# Altium project 1090-MHz-ADS-B-Receiver.PrjPcb
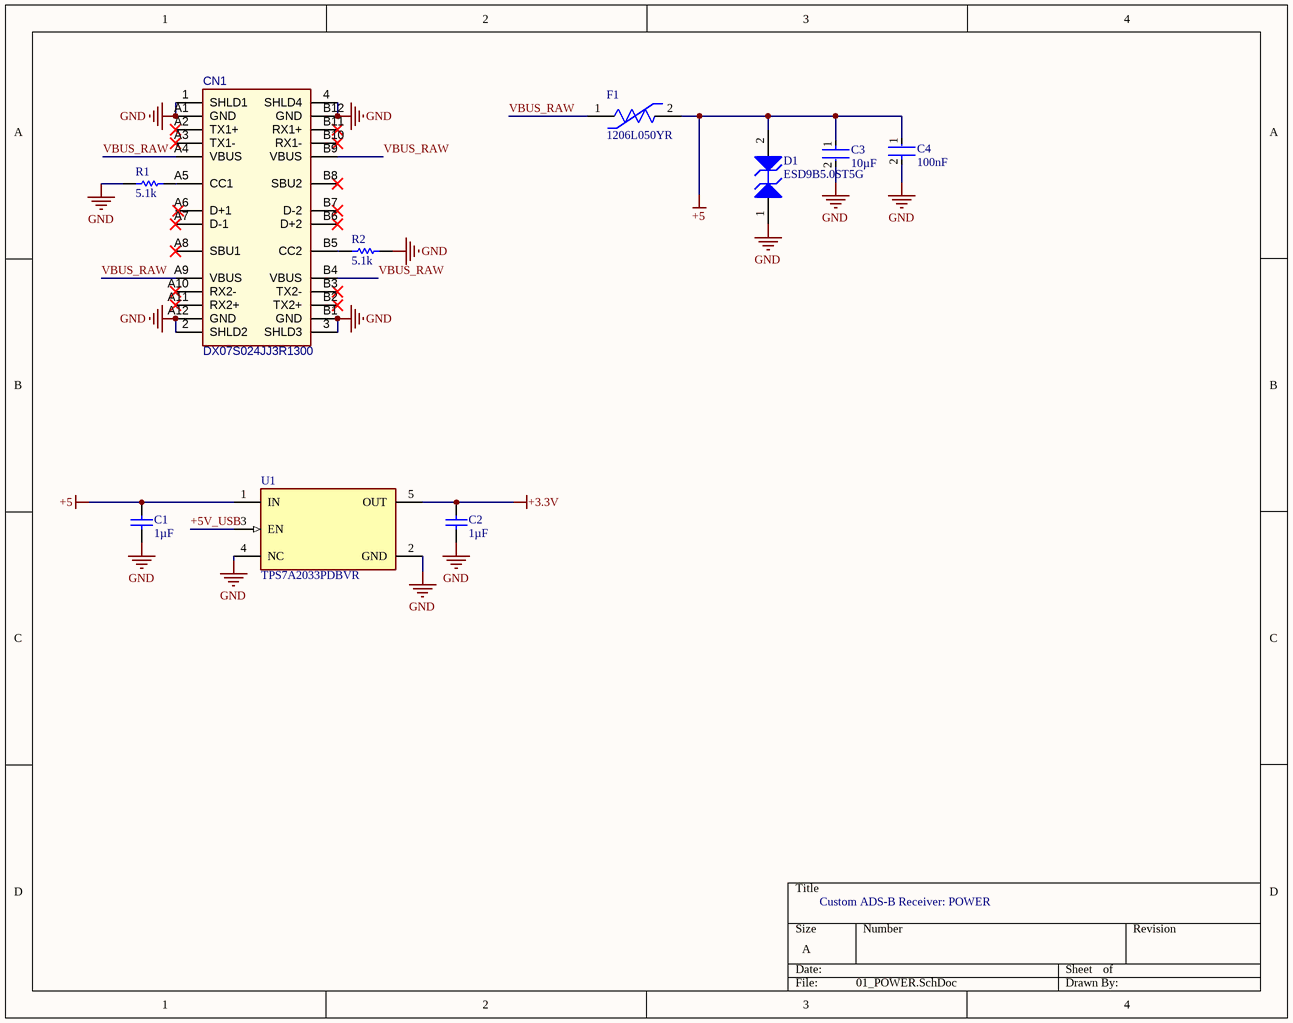
[diagram p0: 01_POWER.SchDoc]
3 sheets, 30 parts. Net scope: global (net labels, ports and power ports of the same name join across sheets).
Board file: PCB1.PcbDoc
Sheets:
  01_POWER.SchDoc
  02_RF_FRONT_END.SchDoc
  03_DETECTOR_COMPARATOR.SchDoc

## Sheet 01_POWER.SchDoc
size A; SheetNumber: 1; SheetTotal: 3

### Parts
C1  value 1µF  [RESC1608X100N]  (hidden comment: GRM188R61A105KA61D)
C2  value 1µF  [RESC1608X100N]  (hidden comment: GRM188R61A105KA61D)
C3  value 10µF  [FP-GRM18-0_15-MFG]  (hidden comment: GRM188R61A106KE69D)
C4  value 100nF  [FP-GRM15-MFG]  (hidden comment: GRM155R71C104KA88D)
CN1  DX07S024JJ3R1300  [JAE-DX07S024JJ3_V]
D1  ESD9B5.0ST5G  [ONSC-SOD-923-2-514AB-01_V]
F1  1206L050YR  [FP-1206L050YR-MFG]
R1  value 5.1k  [RESC1005X40X25NL05T10]  (hidden comment: RC0402FR-075K1L)
R2  value 5.1k  [RESC1005X40X25NL05T10]  (hidden comment: RC0402FR-075K1L)
U1  TPS7A2033PDBVR  [FP-DBV0005A-MFG]

### Nets
+3.3V: C2.2 U1.5(OUT)
+5: C1.2 C3.1 C4.1 D1.2(A2) F1.2 U1.1(IN)
GND: C1.1 C2.1 C3.2 C4.2 CN1.1(SHLD1) CN1.2(SHLD2) CN1.3(SHLD3) CN1.4(SHLD4) CN1.A1(GND) CN1.A12(GND) CN1.B1(GND) CN1.B12(GND) D1.1(A1) R1.1 R2.2 U1.2(GND) U1.4(NC)
+5V_USB: U1.3(EN)
VBUS_RAW: CN1.A4(VBUS) CN1.A9(VBUS) CN1.B4(VBUS) CN1.B9(VBUS) F1.1
NetCN1_A5: CN1.A5(CC1) R1.2
NetCN1_B5: CN1.B5(CC2) R2.1

Not connected (* = marked no-connect by the designer): CN1 A2(TX1+)* A3(TX1-)* A6(D+1) A7(D-1)* A8(SBU1)* A10(RX2-)* A11(RX2+)* B2(TX2+)* B3(TX2-)* B6(D+2)* B7(D-2)* B8(SBU2)* B10(RX1-)* B11(RX1+)*

### Notes on the sheet
- Custom ADS-B Receiver: POWER

### Library data of the parts
C1 C2 = CMP-001-00092-1: 0603 1 uF 10 V ±10% Tolerance X5R SMT Multilayer Ceramic Capacitor; Voltage Rating: 10V; Max Operating Temperature: 85°C; Tolerance: 10%; Case/Package: 0603; Pins: 2; Mounting Technology: Surface Mount; Min Operating Temperature: -55°C
C3 = CMP-001-00094-1: Multilayer Ceramic Capacitor, 10 uF, 10 V, ± 10%, X5R, 0603 [1608 Metric]; Voltage Rating: 10V; Case/Package: 0603; Mounting Technology: Surface Mount; Min Operating Temperature: -55°C; Max Operating Temperature: 85°C; Tolerance: 10%
C4 = CMP-001-00091-1: 16V 100nF X7R ±10% 0402 Multilayer Ceramic Capacitors MLCC - SMD/SMT ROHS; Mounting Technology: Surface Mount; Min Operating Temperature: -55°C; Voltage Rating: 16V; Max Operating Temperature: 125°C; Tolerance: 10%; Case/Package: 0402; Pins: 2
CN1 = CMP-002-00065-3: USB-C Connector, 20 V, 1.25 A, -30 to 80 degC, RoHS, Tape and Reel; Gender: Receptacle; Pins: 28; Connector Type: USB-C
D1 = CMP-004-00036-1: Tvs Diodes & Esd Suppressors; ESD9B5.0ST5G; on Semiconductor; 5 V; 2; 15 V; 5.8 V; Max Surge Current: 1A; Min Operating Temperature: -55°C; Pins: 2; Max Operating Temperature: 150°C; Case/Package: SOD-923-2
F1 = CMP-005-00013-1: PTC Resettable Fuse 0.5A(hold) 1A(trip) 6VDC 100A 0.6W 0.1s 0.15Ohm SMD Solder Pad 1206 T/R; Min Operating Temperature: -40°C; Mounting Technology: Surface Mount; Max Operating Temperature: 85°C; Current Rating: 100A; Case/Package: 1206
R1 R2 = CMP-009-00177-1: 62.5mW Thick Film Resistors 50V ±100ppm/℃ ±1% 5.1kΩ 0402 Chip Resistor - Surface Mount ROHS; Voltage Rating: 50V; Case/Package: 0402; Min Operating Temperature: -55°C; Max Operating Temperature: 155°C; Tolerance: 1%; Pins: 2; Mounting Technology: Surface Mount
U1 = CMP-019-00050-1: 300mA ultra-low-noise low-IQ low-dropout (LDO) linear regulator with high PSRR 5-SOT-23 -40 to 125; Nominal Supply Current: 6.5µA; Dropout Voltage: 145mV; Output Voltage: 3.3V; Max Supply Voltage: 6V; Min Supply Voltage: 1.6V; Output Current: 300mA; Max Operating Temperature: 125°C; Case/Package: SOT-23; Min Operating Temperature: -40°C; Pins: 5

## Sheet 02_RF_FRONT_END.SchDoc
size A; SheetNumber: 2; SheetTotal: 2
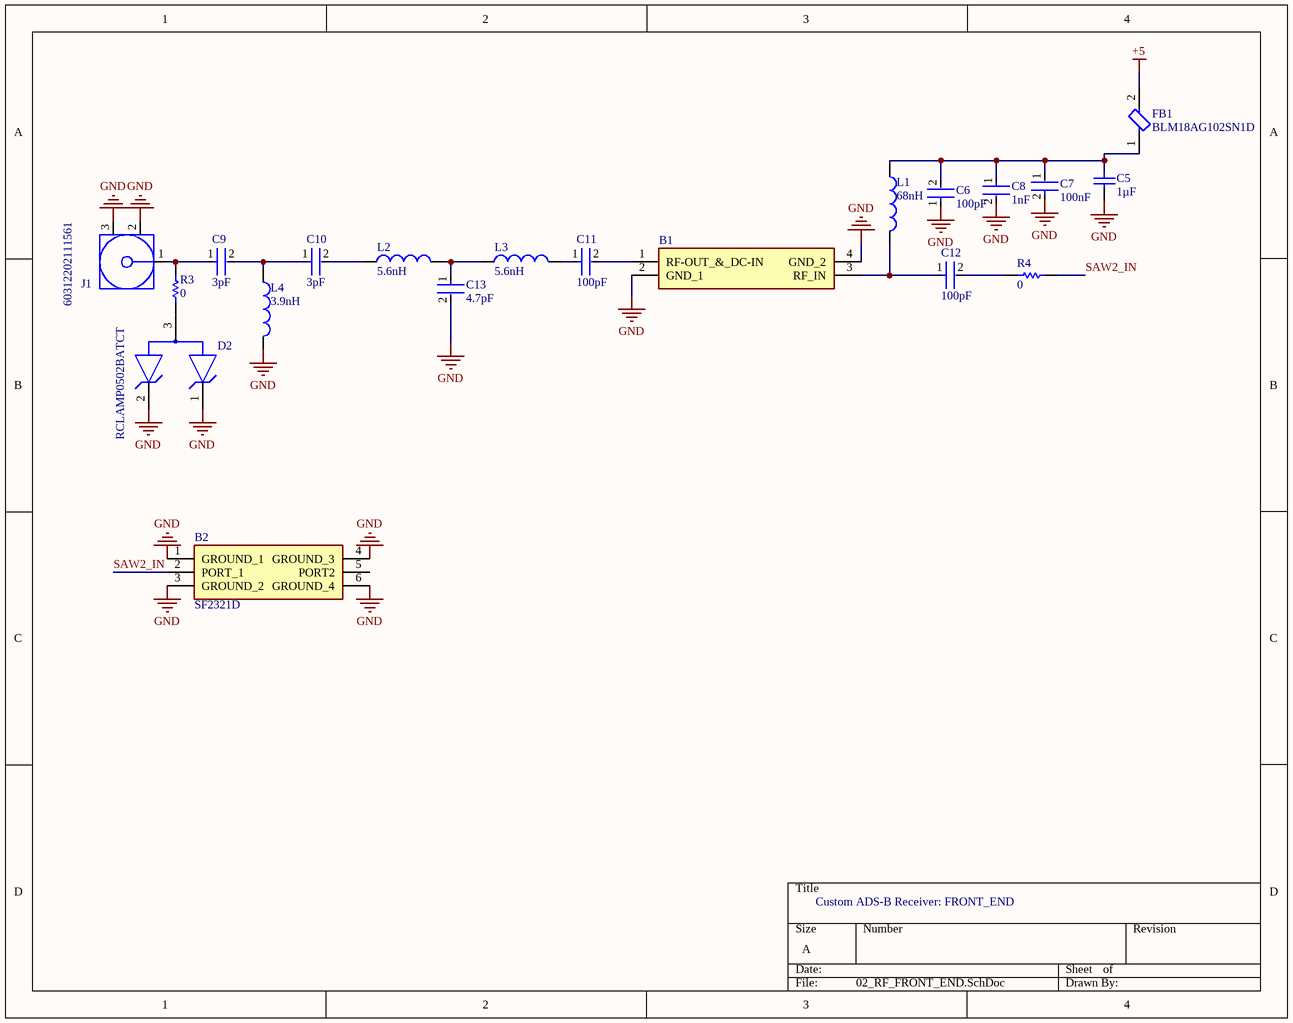
[diagram p1: 02_RF_FRONT_END.SchDoc]

### Parts
B1  PSA4-5043+  [PSA45043]  (value not drawn)
B2  SF2321D  [SF2321D]
C5  value 1µF  [RESC1608X100N]  (hidden comment: GRM188R61A105KA61D)
C6  value 100pF  [FP-GCM155-0_05-MFG]  (hidden comment: GCM1555C1H101JA16J)
C7  value 100nF  [FP-GRM15-MFG]  (hidden comment: GRM155R71C104KA88D)
C8  value 1nF  [FP-GRM155-0_05-MFG]  (hidden comment: GRM1555C1H102JA01D)
C9  value 3pF  [FP-GJM155-0_05-IPC_A]  (hidden comment: GJM1555C1H3R0CB01D)
C10  value 3pF  [FP-GJM155-0_05-IPC_A]  (hidden comment: GJM1555C1H3R0CB01D)
C11  value 100pF  [FP-GCM155-0_05-MFG]  (hidden comment: GCM1555C1H101JA16J)
C12  value 100pF  [FP-GCM155-0_05-MFG]  (hidden comment: GCM1555C1H101JA16J)
C13  value 4.7pF  [FP-GJM155-0_05-MFG]  (hidden comment: GJM1555C1H4R7CB01D)
D2  RCLAMP0502BATCT  [FP-SC75-IPC_A]
FB1  BLM18AG102SN1D  [FP-BLM18-0_15-t0_8-MFG]
J1  60312202111561  [60312202111561]
L1  value 68nH  [INDC1811X102N]  (hidden comment: Coilcraft 0603CS-68NX)
L2  value 5.6nH  [INDC1811X100N]  (hidden comment: 0603CS5N6XJRW)
L3  value 5.6nH  [INDC1811X102N]  (hidden comment: 0603CS5N6XJRW)
L4  value 3.9nH  [INDC1811X100N]  (hidden comment: 0603CS-3N9XJRW)
R3  value 0  [RESC1608X55X25ML10T15]  (hidden comment: Resistor 0R +/- 5% 0603 100 mW)
R4  value 0  [RESC1608X55X25ML10T15]  (hidden comment: Resistor 0R +/- 5% 0603 100 mW)

### Nets
+5: FB1.2
GND: B1.2(GND_1) B1.4(GND_2) B2.1(GROUND_1) B2.3(GROUND_2) B2.4(GROUND_3) B2.6(GROUND_4) C5.1 C6.1 C7.2 C8.2 C13.2 D2.1(1_CATHODE) D2.2(2_CATHODE) J1.2(GND) J1.3(GND) L4.2
SAW2_IN: B2.2(PORT_1) R4.1
NetB1_1: B1.1(RF-OUT_&_DC-IN) C11.2
NetB1_3: B1.3(RF_IN) C12.1 L1.2
NetC5_2: C5.2 C6.2 C7.1 C8.1 FB1.1 L1.1
NetC9_1: C9.1 J1.1(Signal) R3.2
NetC9_2: C9.2 C10.1 L4.1
NetC10_2: C10.2 L2.1
NetC11_1: C11.1 L3.2
NetC12_2: C12.2 R4.2
NetC13_1: C13.1 L2.2 L3.1
NetD2_3: D2.3(COMMON_ANODE) R3.1

Not connected (* = marked no-connect by the designer): B2 5(PORT2)

### Notes on the sheet
- Custom ADS-B Receiver: FRONT_END

### Library data of the parts
B1 = CMP-001-00093-3: 0.75DB 50MHZ~4GHZ 18.4DB Cellular, GSM, Gps, Ism, Lte, Wcdma, Wimax, Wlan SOT-343 Rf Amplifiers Rohs; Min Operating Temperature: -40°C; Max Operating Temperature: 85°C
B2 = CMP-007-000000-2: Signal Conditioning 433.92MHZ; Manufacturer_Name: Murata Electronics; Geometry.Height: 1.7mm; Mouser Part Number: 81-SF2321D; Arrow Part Number: *; Mouser Price/Stock: https://www.mouser.co.uk/ProductDetail/Murata-Electronics/SF2321D?qs=rrS6PyfT74ePCD44o7YaTg%3D%3D; Arrow Price/Stock: *; Design Item ID: SF2321D; Manufacturer_Part_Number: SF2321D; Datasheet Link: https://www.mouser.cn/datasheet/2/281/sf2321d-1309024.pdf; Source: SF2321D.SchLib
C5 = CMP-001-00092-1: as C1 on sheet 01_POWER; Max Operating Temperature: 85°C; Tolerance: 10%; Case/Package: 0603; Pins: 2; Mounting Technology: Surface Mount; Min Operating Temperature: -55°C
C6 C11 C12 = CMP-001-00097-1: 50V 100pF C0G ±5% 0402 Multilayer Ceramic Capacitors MLCC - SMD/SMT ROHS; Tolerance: 5%; Min Operating Temperature: -55°C; Max Operating Temperature: 125°C; Case/Package: 0402; Voltage Rating: 50V; Mounting Technology: Surface Mount
C7 = CMP-001-00091-1: as C4 on sheet 01_POWER; Mounting Technology: Surface Mount; Min Operating Temperature: -55°C; Voltage Rating: 16V; Max Operating Temperature: 125°C; Tolerance: 10%; Case/Package: 0402; Pins: 2
C8 = CMP-001-00090-1: 50V 1nF C0G ±5% 0402 Multilayer Ceramic Capacitors MLCC - SMD/SMT ROHS; Mounting Technology: Surface Mount; Case/Package: 0402; Voltage Rating: 50V; Pins: 2; Max Operating Temperature: 125°C; Tolerance: 5%; Min Operating Temperature: -55°C
C9 C10 = CMP-001-00095-1: 0402 3 pF 50V ±0.25 pF Tolerance C0G SMT Multilayer Ceramic Capacitor; Min Operating Temperature: -55°C; Max Operating Temperature: 125°C; Mounting Technology: Surface Mount; Voltage Rating: 50V; Case/Package: 0402
C13 = CMP-001-00096-1: 0402 4.7pF 50V ±0.25 pF Tolerance C0G SMT Multilayer Ceramic Capacitor; Pins: 2; Mounting Technology: Surface Mount; Voltage Rating: 50V; Min Operating Temperature: -55°C; Case/Package: 0402; Max Operating Temperature: 125°C
D2 = CMP-004-00033-1: ESD Suppressor Diode TVS Uni-Dir/Bi-Dir 5V 3-Pin SOT-523 T/R / TVS DIODE 5VWM 25VC SC75; Pins: 3; Min Operating Temperature: -55°C; Max Operating Temperature: 125°C
FB1 = CMP-005-00014-1: Ferrite Beads Multi-Layer 1KOhm 25% 100MHz 400mA 500mOhm DCR 0603 T/R; Pins: 2; Mounting Technology: Surface Mount; Max Operating Temperature: 125°C; Current Rating: 400mA; Case/Package: 0603; Min Operating Temperature: -55°C
J1 = CMP-00025-00003-1: Rf Conn, Sma, Jack, 50 Ohm, End Launch Rohs Compliant: Yes; Max Operating Temperature: 165°C; Min Operating Temperature: -65°C
L1 = CMP-006-00025-1: RF inductor, ceramic core, 2% tol, SMT, RoHS, halogen-free
L2 = CMP-006-00023-1: General Purpose Inductor, 0.0056uH, 5%, 1 Element, Ceramic-Core, SMD, 0603; Self Resonant Frequency: 4.76GHz; Max Current Rating: 700mA; Min Operating Temperature: -40°C; Tolerance: 5%; Case/Package: 0603; Max Operating Temperature: 125°C
L3 = CMP-006-00024-1: General Purpose Inductor, 0.0056uH, 5%, 1 Element, Ceramic-Core, SMD, 0603; Max Current Rating: 700mA; Self Resonant Frequency: 4.76GHz; Max Operating Temperature: 125°C; Case/Package: 0603; Tolerance: 5%; Min Operating Temperature: -40°C
L4 = CMP-006-00022-1: General Purpose Inductor, 0.0039uH, 5%, 1 Element, Ceramic-Core, SMD, 0603; Max Current Rating: 700mA; Self Resonant Frequency: 6.9GHz; Min Operating Temperature: -40°C; Case/Package: 0603; Max Operating Temperature: 125°C; Tolerance: 5%
R3 R4 = CMP-009-00006-5: Chip Resistor, 0 Ohm, 0.1 W, -55 to 155 degC, 0603 (1608 Metric); Power: 100mW; Voltage Rating: 50V; Max Operating Temperature: 155°C; RoHS Compliant: True; Mounting Technology: SM; Case/Package: 0603; Min Operating Temperature: -55°C; Tolerance: 5%; Pins: 2

## Sheet 03_DETECTOR_COMPARATOR.SchDoc
size A; SheetNumber: 3; SheetTotal: 3
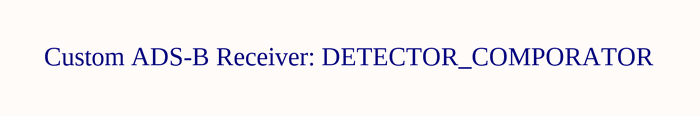
[diagram p2: 03_DETECTOR_COMPARATOR.SchDoc]

### Notes on the sheet
- Custom ADS-B Receiver: DETECTOR_COMPORATOR

## Nets that join several sheets
+5: 01_POWER (6 pins), 02_RF_FRONT_END (FB1.2)
GND: 01_POWER (17 pins), 02_RF_FRONT_END (16 pins)